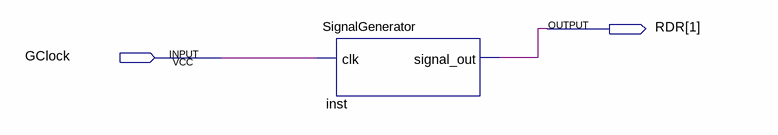
[diagram p0: schematic sheet]
// Quartus schematic testing_clk.bdf as structural Verilog: 1 symbols, 2 pins
module testing_clk (
  input  GClock,
  output [1:1] RDR
);

  SignalGenerator inst (.clk(GClock), .signal_out(RDR[1]));
endmodule
